# EasyEDA schematic SCH_RC Transmitter (controller)_2023-10-06.json

## Sheets
1 Sheet_1: TITLE: Pi Pico Nrf24l01 transmitter Rc Controller; REV: 1.0; Date: 2023-10-06; Sheet: 1/1; Drawn By: alphonsejmr; Company: Reitz Now
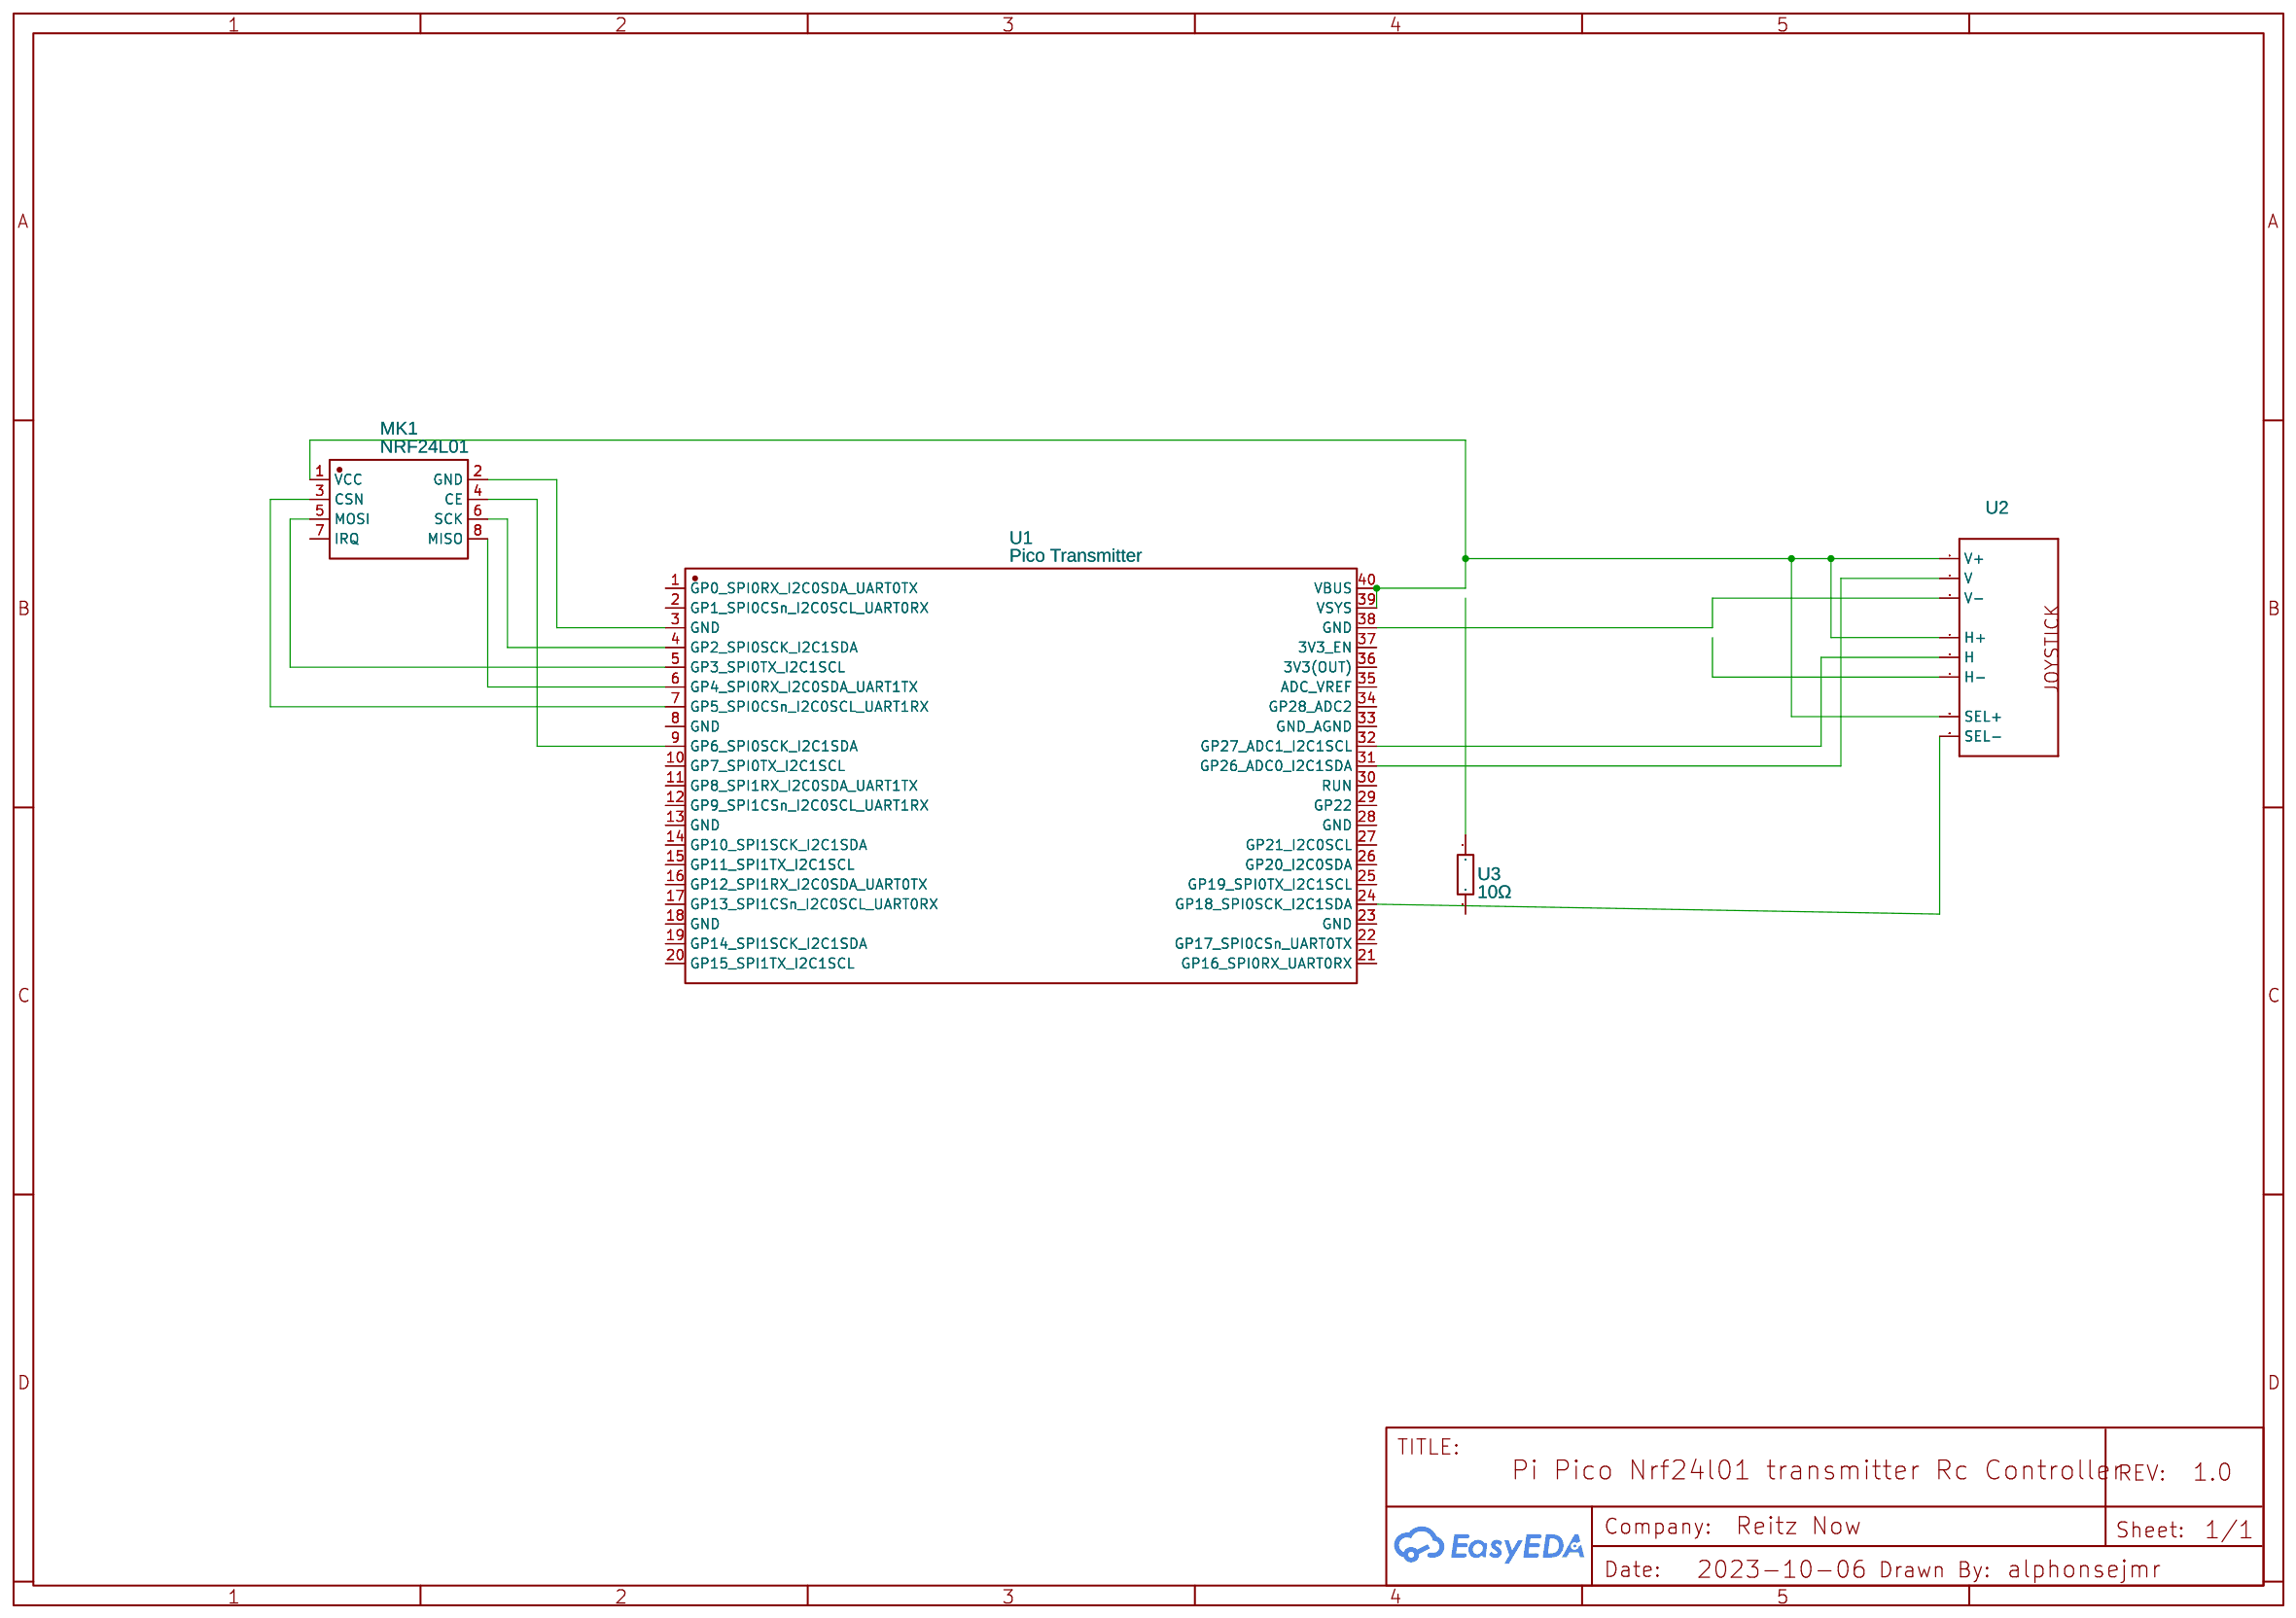
[diagram p0: Sheet_1]
2 Sheet_1#2: TITLE: RC Car Driver Board
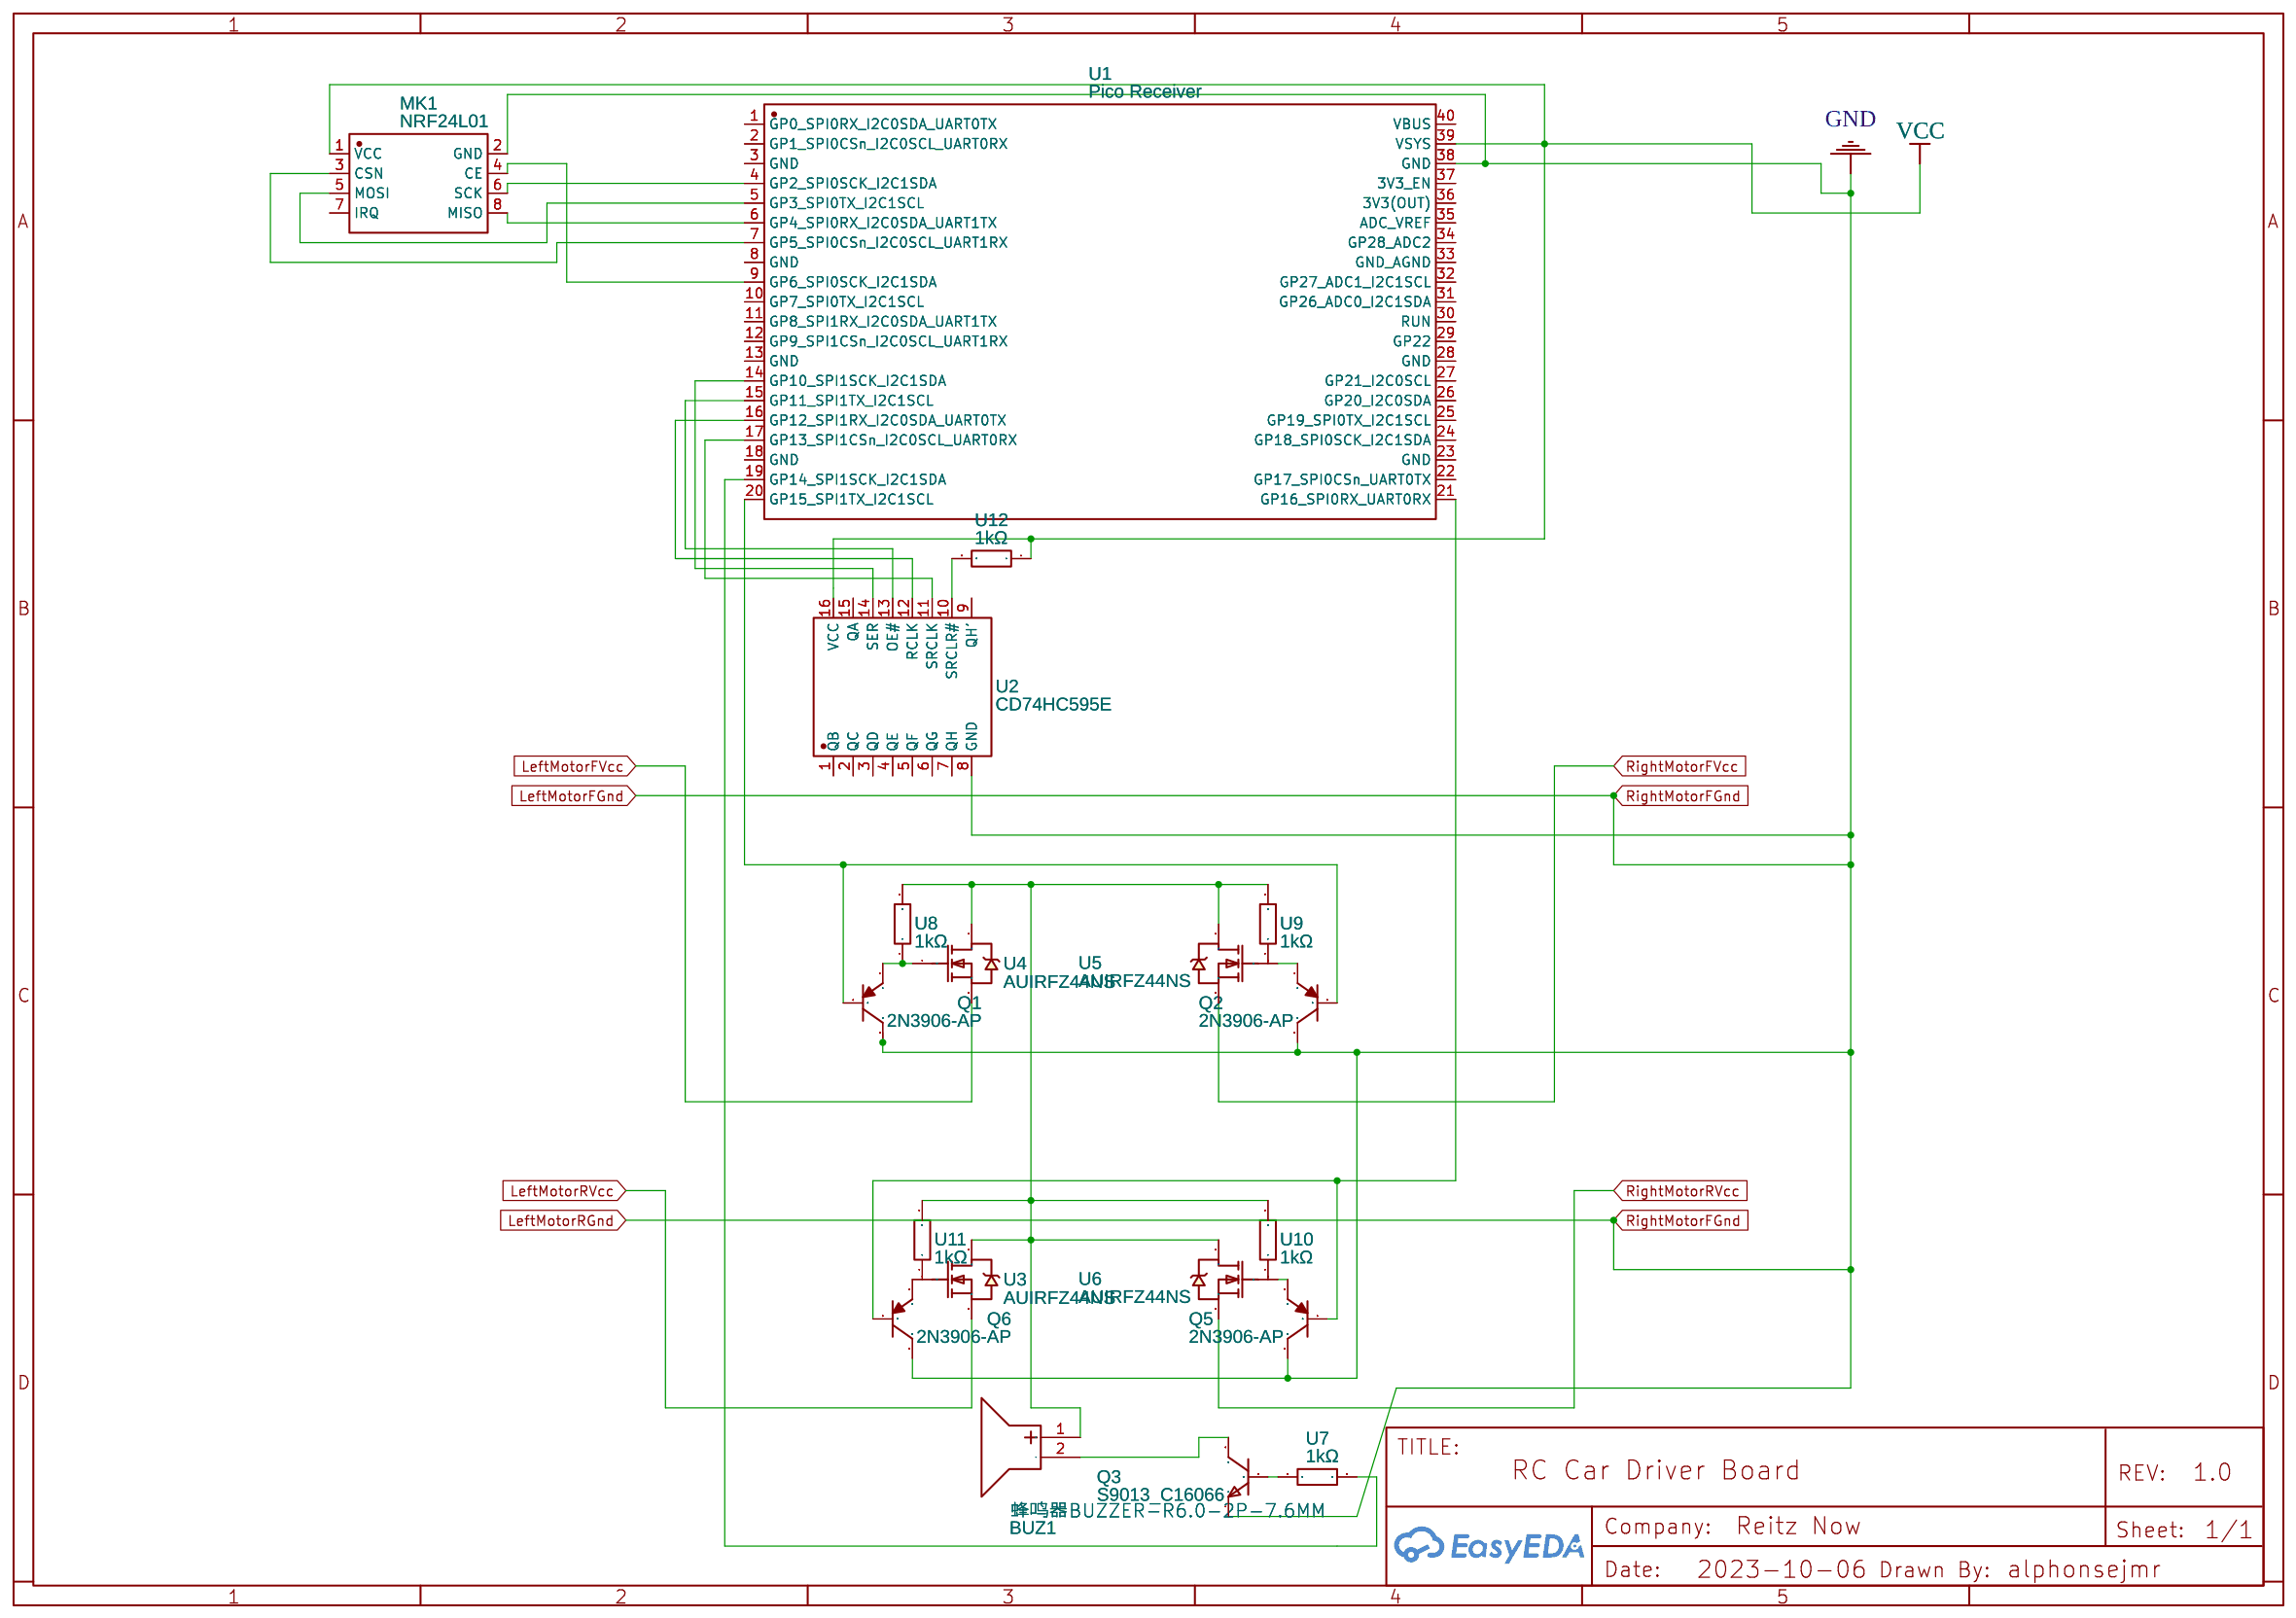
[diagram p1: Sheet_1#2]

## Parts
sheet Sheet_1#2
BUZ1  蜂鸣器BUZZER-R6.0-2P-7.6MM  [BUZ-TH_BD23.0-P15.00-D0.8-FD]
MK1#2  NRF24L01  [WIRELM-SMD_NRF24L01]
Q1  2N3906-AP  [TO-92-3_L4.8-W3.7-P2.54-L]
Q2  2N3906-AP  [TO-92-3_L4.8-W3.7-P2.54-L]
Q3  S9013_C16066  [TO-92-3_L4.9-W3.7-P1.27-L]
Q5  2N3906-AP  [TO-92-3_L4.8-W3.7-P2.54-L]
Q6  2N3906-AP  [TO-92-3_L4.8-W3.7-P2.54-L]
U1#2  Pico Receiver  [LCC-40_L51.0-W21.0-P2.54-BL_RP2040-BASED]
U2#2  CD74HC595E  [PDIP-16_L19.3-W6.4-P2.54-LS7.9-BL]
U3#2  AUIRFZ44NS  [TO-220AB-3_L10.4-W4.6-P2.54-L]
U4  AUIRFZ44NS  [TO-220AB-3_L10.4-W4.6-P2.54-L]
U5  AUIRFZ44NS  [TO-220AB-3_L10.4-W4.6-P2.54-L]
U6  AUIRFZ44NS  [TO-220AB-3_L10.4-W4.6-P2.54-L]
U7  1kΩ  [RES-TH_BD5.5-L19.0-P23.00-D1.0]
U8  1kΩ  [RES-TH_BD5.5-L19.0-P23.00-D1.0]
U9  1kΩ  [RES-TH_BD5.5-L19.0-P23.00-D1.0]
U10  1kΩ  [RES-TH_BD5.5-L19.0-P23.00-D1.0]
U11  1kΩ  [RES-TH_BD5.5-L19.0-P23.00-D1.0]
U12  1kΩ  [RES-TH_BD5.5-L19.0-P23.00-D1.0]
sheet Sheet_1
MK1  NRF24L01  [WIRELM-SMD_NRF24L01]
U1  Pico Transmitter  [LCC-40_L51.0-W21.0-P2.54-BL_RP2040-BASED]
U2  NO  [JOYSTICK]
U3  10Ω  [RES-TH_BD4.5-L11.0-P15.00-D0.7]

## Library data of the parts
BUZ1 = 蜂鸣器BUZZER-R6.0-2P-7.6MM: Contributor: lcsc; Supplier: LCSC; Supplier Part: C9900016169; Manufacturer: null; JLCPCB Part Class: Extended Part; link: https://lcsc.com/eda_search?q=C9900016169&%26type=1&ref=editor
MK1 MK1#2 = NRF24L01: Supplier: LCSC; Manufacturer: Ai-Thinker(安信可); Manufacturer Part: NF-04; Supplier Part: C90751; JLCPCB Part Class: Extended Part; link: https://lcsc.com/eda_search?q=C90751&%26type=1&ref=editor
Q1 Q2 Q5 Q6 = 2N3906-AP: Contributor: LCSC; Supplier: LCSC; Supplier Part: C2987037; Manufacturer: MCC(美微科); JLCPCB Part Class: Extended Part; link: https://lcsc.com/eda_search?q=C2987037&%26type=1&ref=editor
Q3 = S9013_C16066: Contributor: LCSC; Supplier: LCSC; Supplier Part: C16066; Manufacturer: CJ(江苏长电/长晶); Manufacturer Part: S9013; JLCPCB Part Class: Extended Part; link: https://lcsc.com/eda_search?q=C16066&%26type=1&ref=editor
U1 U1#2 = PICO W: Supplier: LCSC; Supplier Part: C7203003; Manufacturer: Raspberry Pi(树莓派); Contributor: lcsc; JLCPCB Part Class: Extended Part; link: https://lcsc.com/eda_search?q=C7203003&%26type=1&ref=editor
U2#2 = CD74HC595E: Contributor: LCSC; Supplier: LCSC; Supplier Part: C2871902; Manufacturer: TI(德州仪器); link: https://lcsc.com/eda_search?q=C2871902&%26type=1&ref=editor
U3#2 U4-U6 = AUIRFZ44NS: Contributor: lcsc; Supplier: LCSC; Supplier Part: C3290491; Manufacturer: Infineon(英飞凌); link: https://lcsc.com/eda_search?q=C3290491&%26type=1&ref=editor
U7-U12 = PCF1CT631R102K: Contributor: lcsc; Supplier: LCSC; Supplier Part: C782210; Manufacturer: KOA; link: https://lcsc.com/eda_search?q=C782210&%26type=1&ref=editor
U2 = JOYSTICKPTH: Thumb Joystick; Contributor: SparkFun
U3 = FRKNP2WS-10Ω±5%-6T63: Contributor: lcsc; Supplier: LCSC; Supplier Part: C479295; Manufacturer: VO(翔胜); JLCPCB Part Class: Extended Part; link: https://lcsc.com/eda_search?q=C479295&%26type=1&ref=editor

## Nets
GND: MK1#2.2(GND) Q1.3 Q2.3 Q3.1(E) Q5.3 Q6.3 U1#2.38(GND) U2#2.8(GND)
VCC: MK1#2.1(VCC) U1#2.39(VSYS) U2#2.16(VCC) U12.1
LeftMotorFVcc: U4.3(S)
LeftMotorRVcc: U3#2.3(S)
RightMotorFVcc: U5.3(S)
RightMotorRVcc: U6.3(S)
Net-(BUZ1-1): BUZ1.1(+) U3#2.2(D) U4.2(D) U5.2(D) U6.2(D) U8.2 U9.2 U10.2 U11.2
Net-(BUZ1-2): BUZ1.2(-) Q3.3(C)
Net-(MK1#2-3): MK1#2.3(CSN) U1#2.7(GP5_SPI0CSn_I2C0SCL_UART1RX)
Net-(MK1#2-4): MK1#2.4(CE) U1#2.9(GP6_SPI0SCK_I2C1SDA)
Net-(MK1#2-5): MK1#2.5(MOSI) U1#2.5(GP3_SPI0TX_I2C1SCL)
Net-(MK1#2-6): MK1#2.6(SCK) U1#2.4(GP2_SPI0SCK_I2C1SDA)
Net-(MK1#2-8): MK1#2.8(MISO) U1#2.6(GP4_SPI0RX_I2C0SDA_UART1TX)
Net-(MK1-1): MK1.1(VCC) U1.39(VSYS) U1.40(VBUS) U2.B1A(SEL+) U2.H1(H+) U2.V1(V+)
Net-(MK1-2): MK1.2(GND) U1.3(GND)
Net-(MK1-3): MK1.3(CSN) U1.7(GP5_SPI0CSn_I2C0SCL_UART1RX)
Net-(MK1-4): MK1.4(CE) U1.9(GP6_SPI0SCK_I2C1SDA)
Net-(MK1-5): MK1.5(MOSI) U1.5(GP3_SPI0TX_I2C1SCL)
Net-(MK1-6): MK1.6(SCK) U1.4(GP2_SPI0SCK_I2C1SDA)
Net-(MK1-8): MK1.8(MISO) U1.6(GP4_SPI0RX_I2C0SDA_UART1TX)
Net-(Q1-1): Q1.1 U4.1(G) U8.1
Net-(Q1-2): Q1.2 Q2.2 U1#2.20(GP15_SPI1TX_I2C1SCL)
Net-(Q2-1): Q2.1 U5.1(G)
Net-(Q3-2): Q3.2(B) U7.2
Net-(Q5-1): Q5.1 U6.1(G)
Net-(Q5-2): Q5.2 Q6.2 U1#2.21(GP16_SPI0RX_UART0RX)
Net-(Q6-1): Q6.1 U3#2.1(G)
Net-(U1#2-14): U1#2.14(GP10_SPI1SCK_I2C1SDA) U2#2.14(SER)
Net-(U1#2-15): U1#2.15(GP11_SPI1TX_I2C1SCL) U2#2.13(OE#)
Net-(U1#2-16): U1#2.16(GP12_SPI1RX_I2C0SDA_UART0TX) U2#2.12(RCLK)
Net-(U1#2-17): U1#2.17(GP13_SPI1CSn_I2C0SCL_UART0RX) U2#2.11(SRCLK)
Net-(U1#2-19): U1#2.19(GP14_SPI1SCK_I2C1SDA) U7.1
Net-(U1-24): U1.24(GP18_SPI0SCK_I2C1SDA) U2.B2A(SEL-)
Net-(U1-31): U1.31(GP26_ADC0_I2C1SDA) U2.V2(V)
Net-(U1-32): U1.32(GP27_ADC1_I2C1SCL) U2.H2(H)
Net-(U1-38): U1.38(GND) U2.V3(V-)
Net-(U2#2-10): U2#2.10(SRCLR#) U12.2

Not connected (* = marked no-connect by the designer): MK1 7(IRQ); MK1#2 7(IRQ); U1 1(GP0_SPI0RX_I2C0SDA_UART0TX) 2(GP1_SPI0CSn_I2C0SCL_UART0RX) 8(GND) 10(GP7_SPI0TX_I2C1SCL) 11(GP8_SPI1RX_I2C0SDA_UART1TX) 12(GP9_SPI1CSn_I2C0SCL_UART1RX) 13(GND) 14(GP10_SPI1SCK_I2C1SDA) 15(GP11_SPI1TX_I2C1SCL) 16(GP12_SPI1RX_I2C0SDA_UART0TX) 17(GP13_SPI1CSn_I2C0SCL_UART0RX) 18(GND) 19(GP14_SPI1SCK_I2C1SDA) 20(GP15_SPI1TX_I2C1SCL) 21(GP16_SPI0RX_UART0RX) 22(GP17_SPI0CSn_UART0TX) 23(GND) 25(GP19_SPI0TX_I2C1SCL) 26(GP20_I2C0SDA) 27(GP21_I2C0SCL) 28(GND) 29(GP22) 30(RUN) 33(GND_AGND) 34(GP28_ADC2) 35(ADC_VREF) 36(3V3(OUT)) 37(3V3_EN); U1#2 1(GP0_SPI0RX_I2C0SDA_UART0TX) 2(GP1_SPI0CSn_I2C0SCL_UART0RX) 3(GND) 8(GND) 10(GP7_SPI0TX_I2C1SCL) 11(GP8_SPI1RX_I2C0SDA_UART1TX) 12(GP9_SPI1CSn_I2C0SCL_UART1RX) 13(GND) 18(GND) 22(GP17_SPI0CSn_UART0TX) 23(GND) 24(GP18_SPI0SCK_I2C1SDA) 25(GP19_SPI0TX_I2C1SCL) 26(GP20_I2C0SDA) 27(GP21_I2C0SCL) 28(GND) 29(GP22) 30(RUN) 31(GP26_ADC0_I2C1SDA) 32(GP27_ADC1_I2C1SCL) 33(GND_AGND) 34(GP28_ADC2) 35(ADC_VREF) 36(3V3(OUT)) 37(3V3_EN) 40(VBUS); U2 H3(H-); U2#2 1(QB) 2(QC) 3(QD) 4(QE) 5(QF) 6(QG) 7(QH) 9(QH’) 15(QA); U3 1 2; U9 1; U10 1; U11 1
